# EAGLE schematic ma_esquema (EAGLE 7.2.0)
CDESIGNER: Apellido, Nombre; CNAME: MICRO AUTOMATA; CREVISION: 1.0; CSCHO: ESCUELA

## Sheet 1 of 3
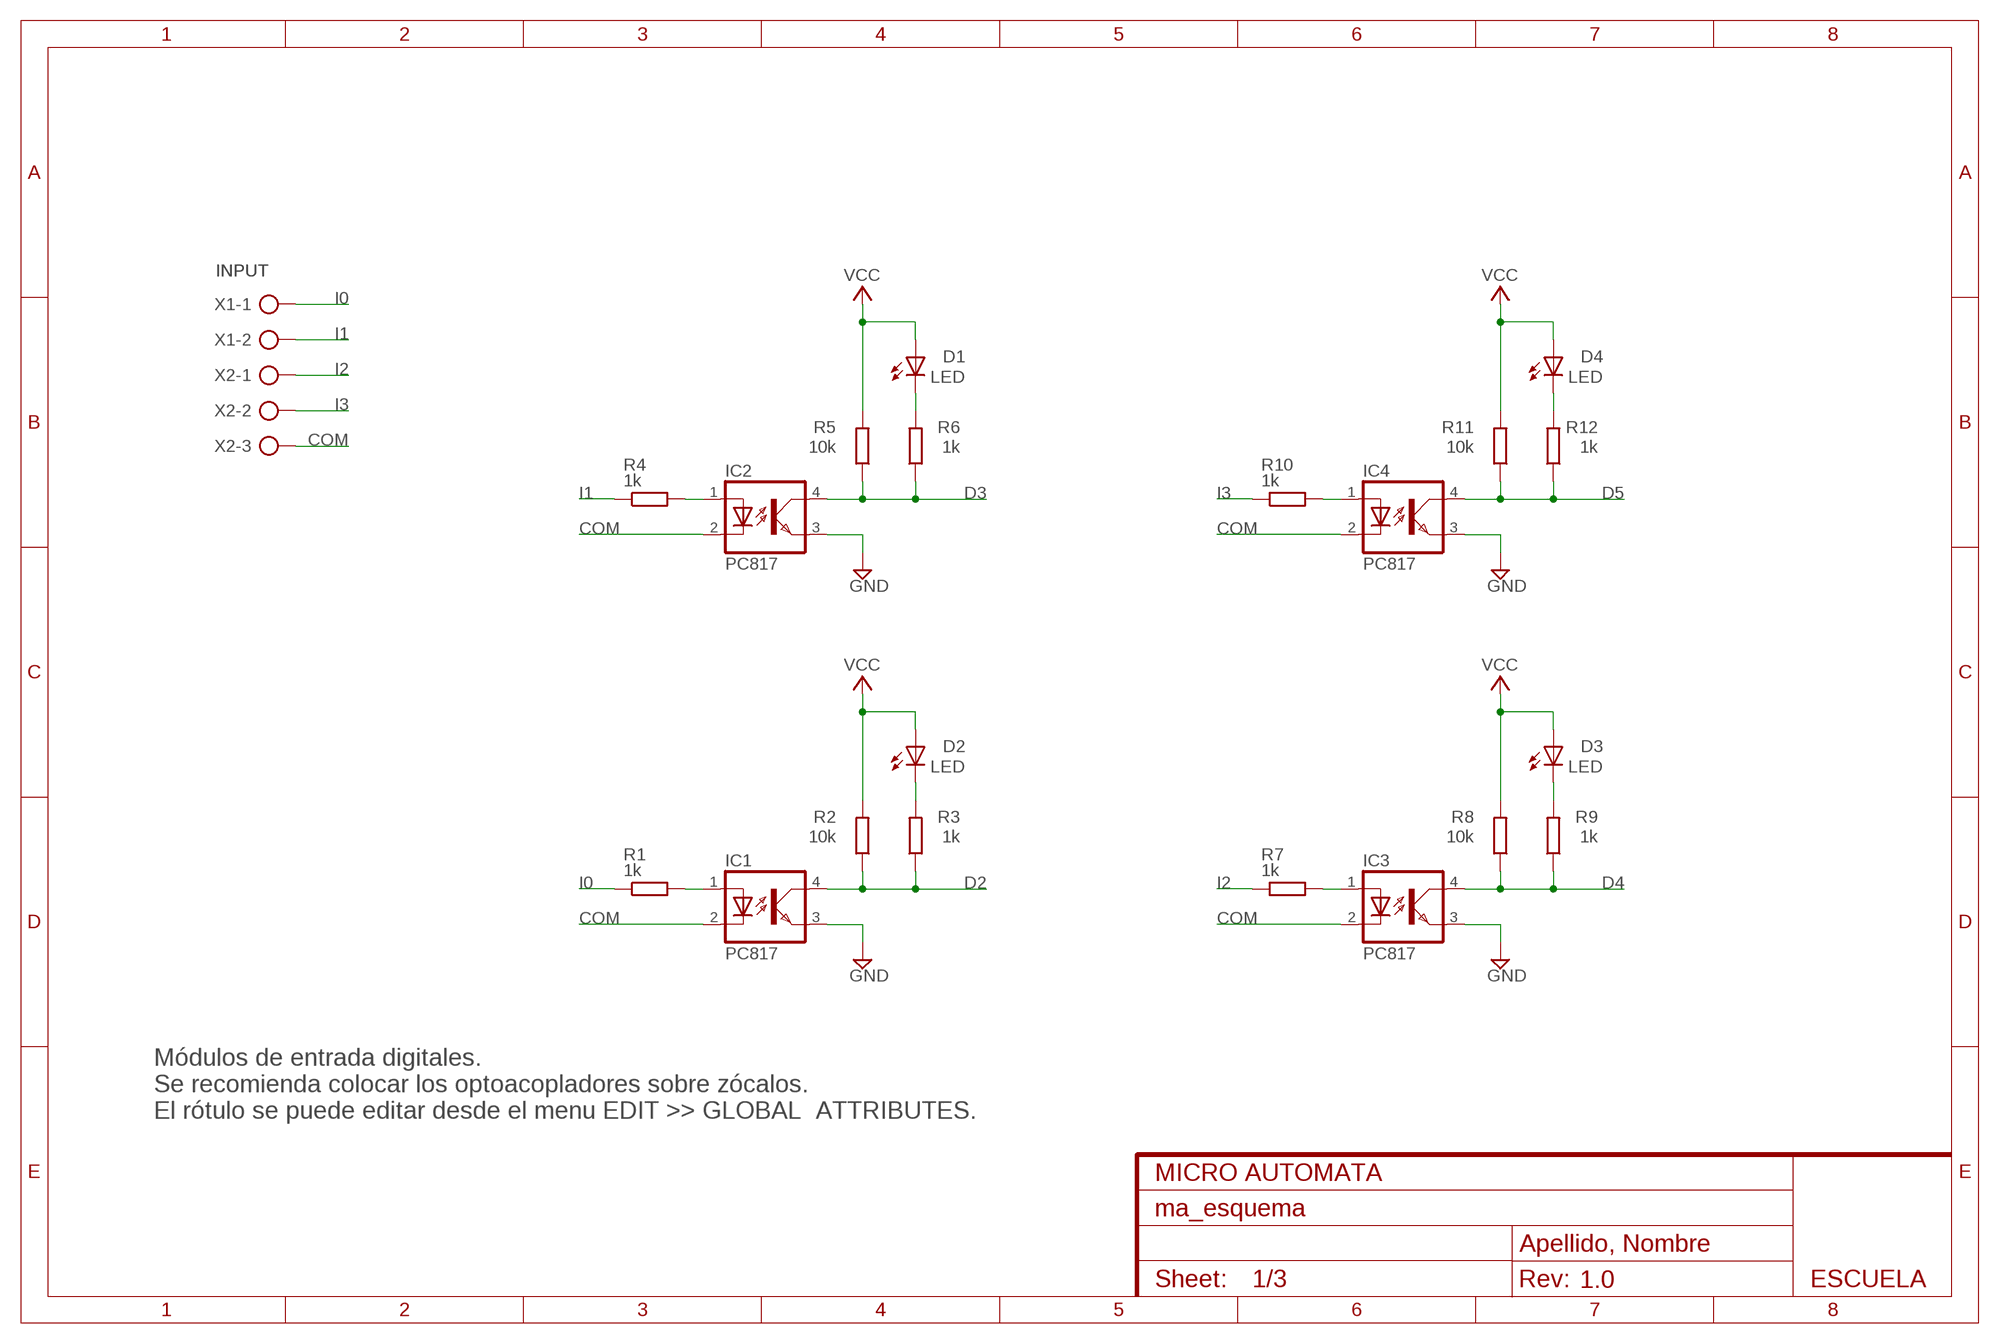
[diagram p0: schematic, sheet 1]

### Parts
D1  LED  LED3MM  [LED_3MM]
D2  LED  LED3MM  [LED_3MM]
D3  LED  LED3MM  [LED_3MM]
D4  LED  LED3MM  [LED_3MM]
IC1  PC817  [DIL04]
IC2  PC817  [DIL04]
IC3  PC817  [DIL04]
IC4  PC817  [DIL04]
R1  1k  RESISTOR-EU0204/7  [0204/7]
R2  10k  RESISTOR-EU0204/7  [0204/7]
R3  1k  RESISTOR-EU0204/7  [0204/7]
R4  1k  RESISTOR-EU0204/7  [0204/7]
R5  10k  RESISTOR-EU0204/7  [0204/7]
R6  1k  RESISTOR-EU0204/7  [0204/7]
R7  1k  RESISTOR-EU0204/7  [0204/7]
R8  10k  RESISTOR-EU0204/7  [0204/7]
R9  1k  RESISTOR-EU0204/7  [0204/7]
R10  1k  RESISTOR-EU0204/7  [0204/7]
R11  10k  RESISTOR-EU0204/7  [0204/7]
R12  1k  RESISTOR-EU0204/7  [0204/7]
X1  INPUT  BORNERA_AK500/2  [AK500/2]
X2  INPUT  BORNERA_AK500/3  [AK500/3]

### Nets
COM: IC1.2(C) IC2.2(C) IC3.2(C) IC4.2(C) X2.3
D2: IC1.4(COL) R2.1 R3.1 ; also sheet 3
D3: IC2.4(COL) R5.1 R6.1 ; also sheet 3
D4: IC3.4(COL) R8.1 R9.1 ; also sheet 3
D5: IC4.4(COL) R11.1 R12.1 ; also sheet 3
GND: IC1.3(EMIT) IC2.3(EMIT) IC3.3(EMIT) IC4.3(EMIT) ; also sheet 2,3
I0: R1.1 X1.1
I1: R4.1 X1.2
I2: R7.1 X2.1
I3: R10.1 X2.2
N$2: IC1.1(A) R1.2
N$5: D2.K(C) R3.2
N$6: IC2.1(A) R4.2
N$8: D1.K(C) R6.2
N$10: IC3.1(A) R7.2
N$12: D3.K(C) R9.2
N$14: IC4.1(A) R10.2
N$16: D4.K(C) R12.2
VCC: D1.A D2.A D3.A D4.A R2.2 R5.2 R8.2 R11.2 ; also sheet 3

### Notes on the sheet
- Módulos de entrada digitales.
  Se recomienda colocar los optoacopladores sobre zócalos.
  El rótulo se puede editar desde el menu EDIT >> GLOBAL  ATTRIBUTES.

## Sheet 2 of 3
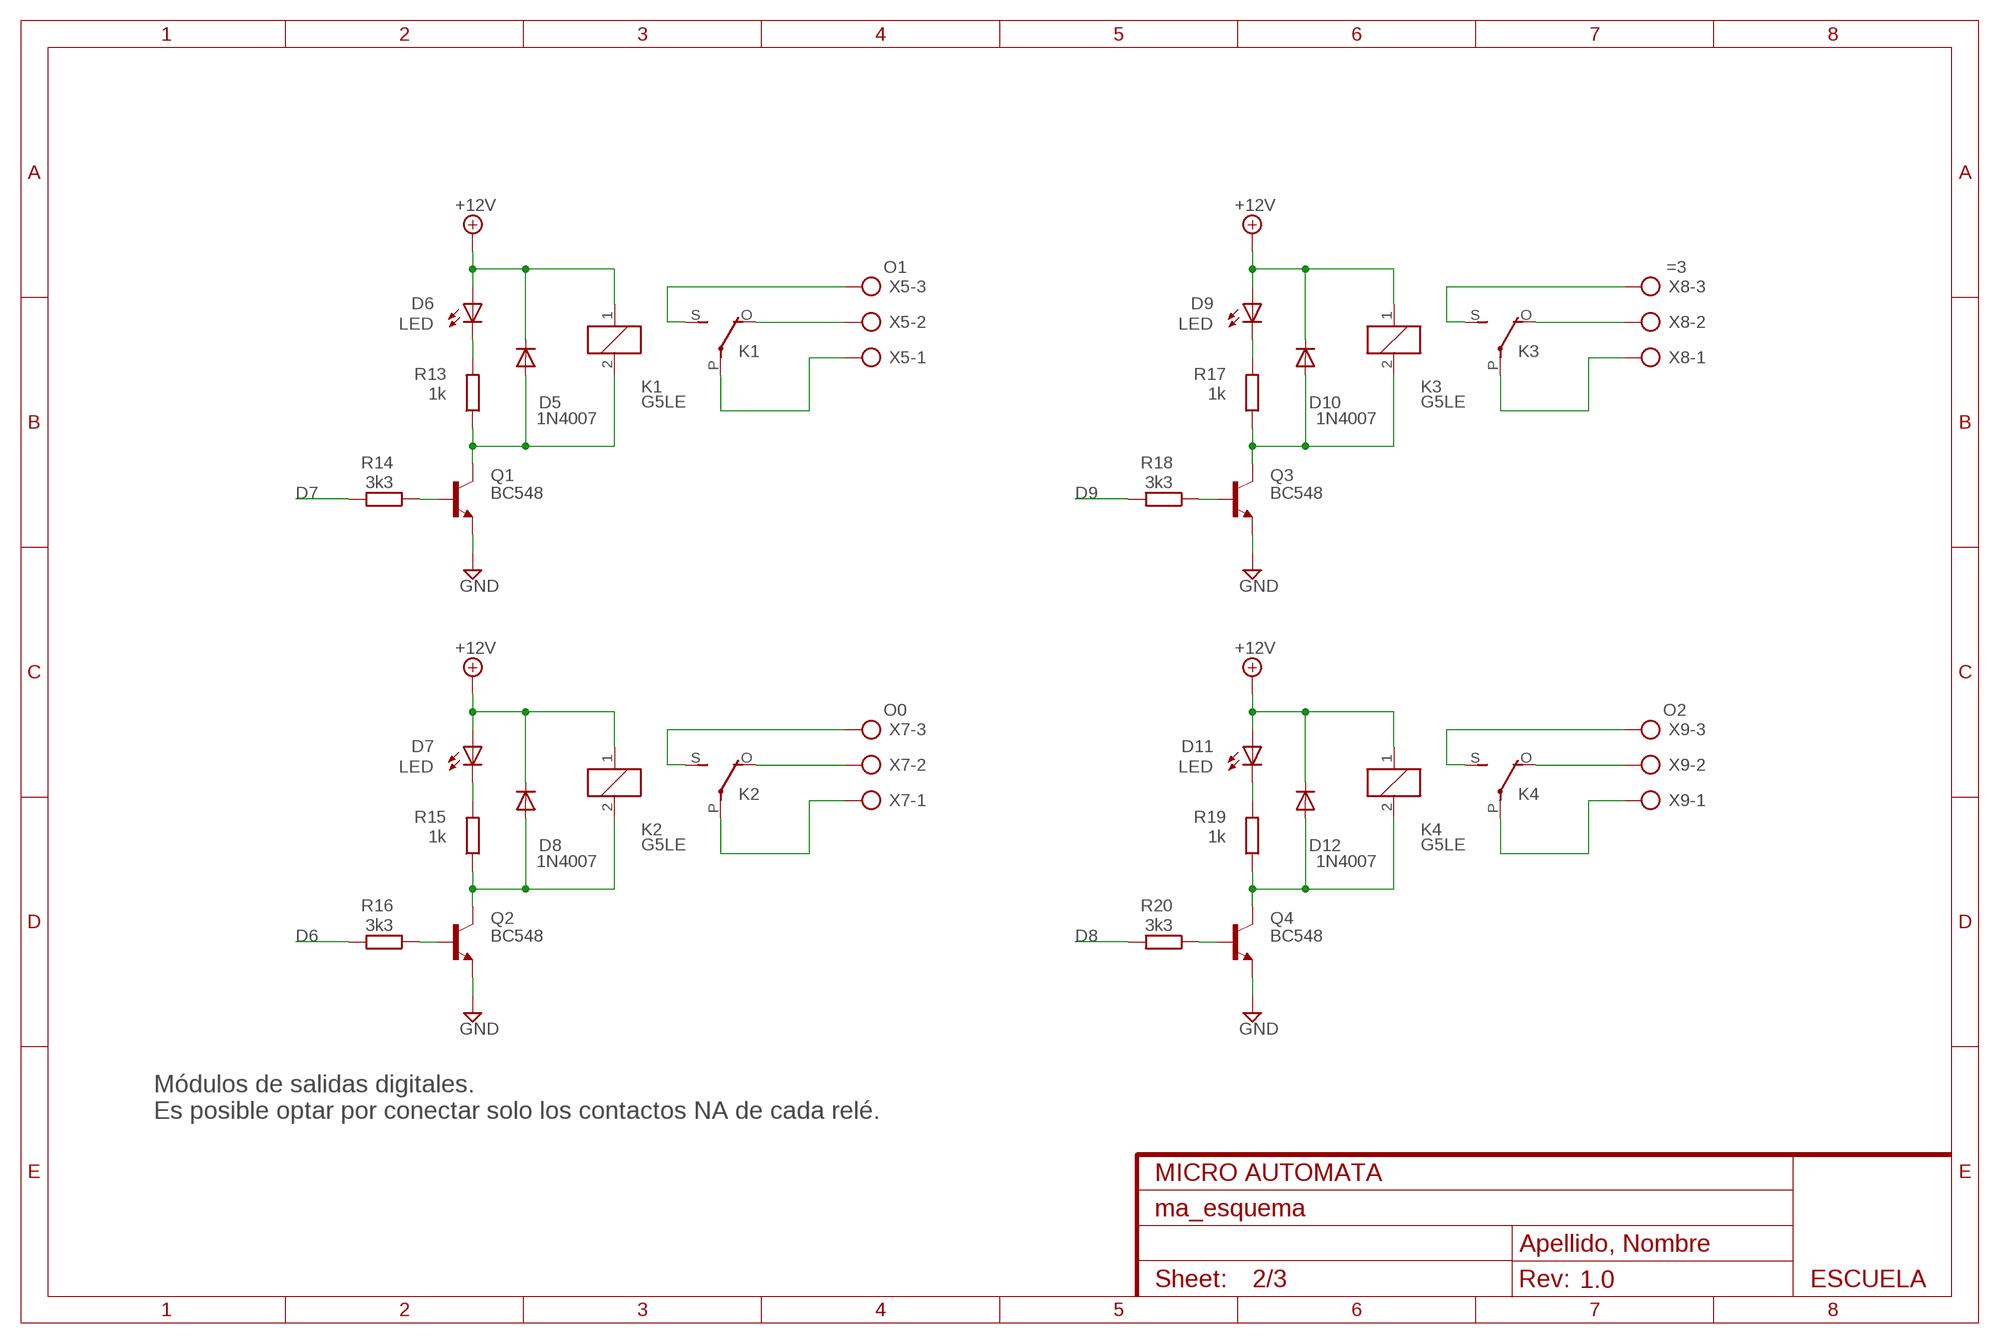
[diagram p1: schematic, sheet 2]

### Parts
D5  1N4007  [DO41-10]
D6  LED  LED3MM  [LED_3MM]
D7  LED  LED3MM  [LED_3MM]
D8  1N4007  [DO41-10]
D9  LED  LED3MM  [LED_3MM]
D10  1N4007  [DO41-10]
D11  LED  LED3MM  [LED_3MM]
D12  1N4007  [DO41-10]
K1  G5LE  RELE_G5LE  [G5LE]
K2  G5LE  RELE_G5LE  [G5LE]
K3  G5LE  RELE_G5LE  [G5LE]
K4  G5LE  RELE_G5LE  [G5LE]
Q1  BC548  [TO92-EBC]
Q2  BC548  [TO92-EBC]
Q3  BC548  [TO92-EBC]
Q4  BC548  [TO92-EBC]
R13  1k  RESISTOR-EU0204/7  [0204/7]
R14  3k3  RESISTOR-EU0204/7  [0204/7]
R15  1k  RESISTOR-EU0204/7  [0204/7]
R16  3k3  RESISTOR-EU0204/7  [0204/7]
R17  1k  RESISTOR-EU0204/7  [0204/7]
R18  3k3  RESISTOR-EU0204/7  [0204/7]
R19  1k  RESISTOR-EU0204/7  [0204/7]
R20  3k3  RESISTOR-EU0204/7  [0204/7]
X5  O1  BORNERA_AK500/3  [AK500/3]
X7  O0  BORNERA_AK500/3  [AK500/3]
X8  =3  BORNERA_AK500/3  [AK500/3]
X9  O2  BORNERA_AK500/3  [AK500/3]

### Nets
+12V: D5.C D6.A D7.A D8.C D9.A D10.C D11.A D12.C K1.1 K2.1 K3.1 K4.1 ; also sheet 3
D6: R16.2 ; also sheet 3
D7: R14.2 ; also sheet 3
D8: R20.2 ; also sheet 3
D9: R18.2 ; also sheet 3
GND: Q1.E Q2.E Q3.E Q4.E ; also sheet 1,3
N$17: K1.P(2:COM) X5.1
N$18: D6.K(C) R13.2
N$19: D5.A K1.2 Q1.C R13.1
N$20: K1.O(2:NC) X5.2
N$21: K1.S(2:NA) X5.3
N$23: Q1.B R14.1
N$24: D7.K(C) R15.2
N$25: D8.A K2.2 Q2.C R15.1
N$26: K2.P(2:COM) X7.1
N$27: K2.O(2:NC) X7.2
N$28: K2.S(2:NA) X7.3
N$29: Q2.B R16.1
N$30: D9.K(C) R17.2
N$31: D10.A K3.2 Q3.C R17.1
N$32: K3.P(2:COM) X8.1
N$33: K3.O(2:NC) X8.2
N$34: K3.S(2:NA) X8.3
N$35: Q3.B R18.1
N$36: D11.K(C) R19.2
N$37: D12.A K4.2 Q4.C R19.1
N$38: K4.P(2:COM) X9.1
N$39: K4.O(2:NC) X9.2
N$40: K4.S(2:NA) X9.3
N$41: Q4.B R20.1

### Notes on the sheet
- Módulos de salidas digitales.
  Es posible optar por conectar solo los contactos NA de cada relé.

## Sheet 3 of 3
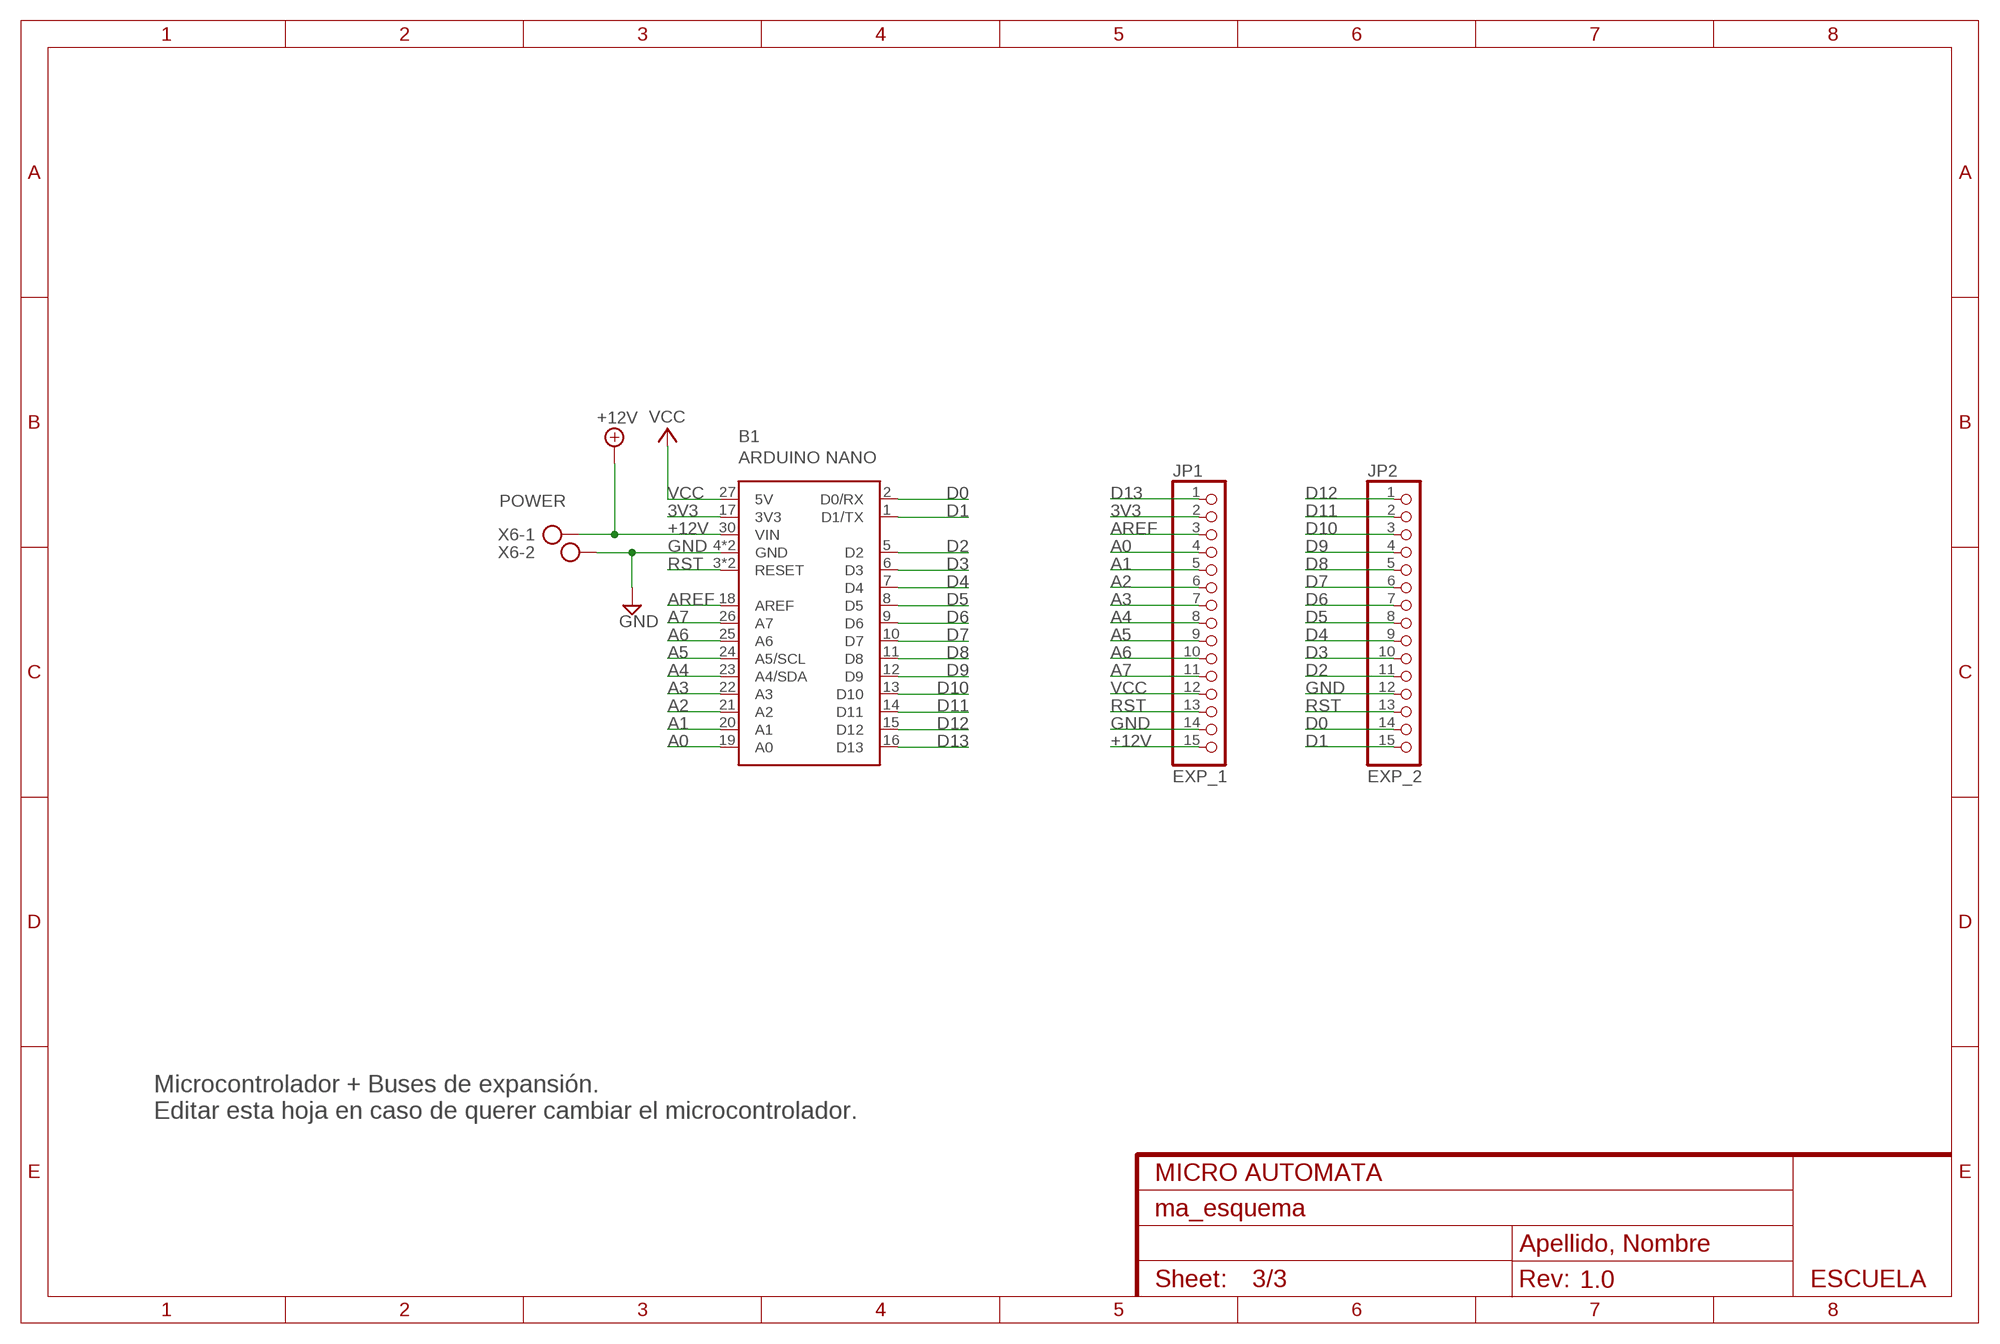
[diagram p2: schematic, sheet 3]

### Parts
B1  ARDUINO NANO  ARDUINO_NANO  [NANO]
JP1  EXP_1  PINHD-1X15  [1X15]
JP2  EXP_2  PINHD-1X15  [1X15]
X6  POWER  BORNERA_AK500/2  [AK500/2]

### Nets
3V3: B1.17(3V3) JP1.2
+12V: B1.30(VIN) JP1.15 X6.1 ; also sheet 2
A0: B1.19(A0) JP1.4
A1: B1.20(A1) JP1.5
A2: B1.21(A2) JP1.6
A3: B1.22(A3) JP1.7
A4: B1.23(A4/SDA) JP1.8
A5: B1.24(A5/SCL) JP1.9
A6: B1.25(A6) JP1.10
A7: B1.26(A7) JP1.11
AREF: B1.18(AREF) JP1.3
D0: B1.2(D0/RX) JP2.14
D1: B1.1(D1/TX) JP2.15
D2: B1.5(D2) JP2.11 ; also sheet 1
D3: B1.6(D3) JP2.10 ; also sheet 1
D4: B1.7(D4) JP2.9 ; also sheet 1
D5: B1.8(D5) JP2.8 ; also sheet 1
D6: B1.9(D6) JP2.7 ; also sheet 2
D7: B1.10(D7) JP2.6 ; also sheet 2
D8: B1.11(D8) JP2.5 ; also sheet 2
D9: B1.12(D9) JP2.4 ; also sheet 2
D10: B1.13(D10) JP2.3
D11: B1.14(D11) JP2.2
D12: B1.15(D12) JP2.1
D13: B1.16(D13) JP1.1
GND: B1.4(GND) B1.29(GND) JP1.14 JP2.12 X6.2 ; also sheet 1,2
RST: B1.3(RESET) B1.28(RESET) JP1.13 JP2.13
VCC: B1.27(5V) JP1.12 ; also sheet 1

### Notes on the sheet
- Microcontrolador + Buses de expansión.
  Editar esta hoja en caso de querer cambiar el microcontrolador.

## Library data of the parts
B1 = treser_lib:ARDUINO_NANO: Arduino Nano
D1-D4 D6 D7 D9 D11 = treser_lib:LED: LEDs
D5 D8 D10 D12 = treser_lib:1N4007: Diodo Rectificador Rectificador de proposito general 1N400x.
IC1-IC4 = treser_lib:PC817: Optoacoplador NPN SHARP; MPN: PC817X4J000F; OC_FARNELL: 9707727; OC_NEWARK: 97K7059
JP1 JP2 = pinhead:PINHD-1X15: PIN HEADER
K1-K4 = treser_lib:RELE_G5LE: Relé Simple Inversor 1 x Switch, 10 A/120 V AC, 8 A/30 V DC, Omron.; OC_FARNELL: unknown; OC_NEWARK: unknown
Q1-Q4 = treser_lib:BC548: Transistor NPN
R1-R20 = treser_lib:RESISTOR-EU: Resistor Simbolo europeo.
X1 X6 = treser_lib:BORNERA_AK500/2: Bornera de tornillo; OC_FARNELL: unknown; OC_NEWARK: unknown
X2 X5 X7-X9 = treser_lib:BORNERA_AK500/3: Bornera de tornillo; OC_FARNELL: unknown; OC_NEWARK: unknown